# EAGLE design IMU_PCB (EAGLE 9.6.2)
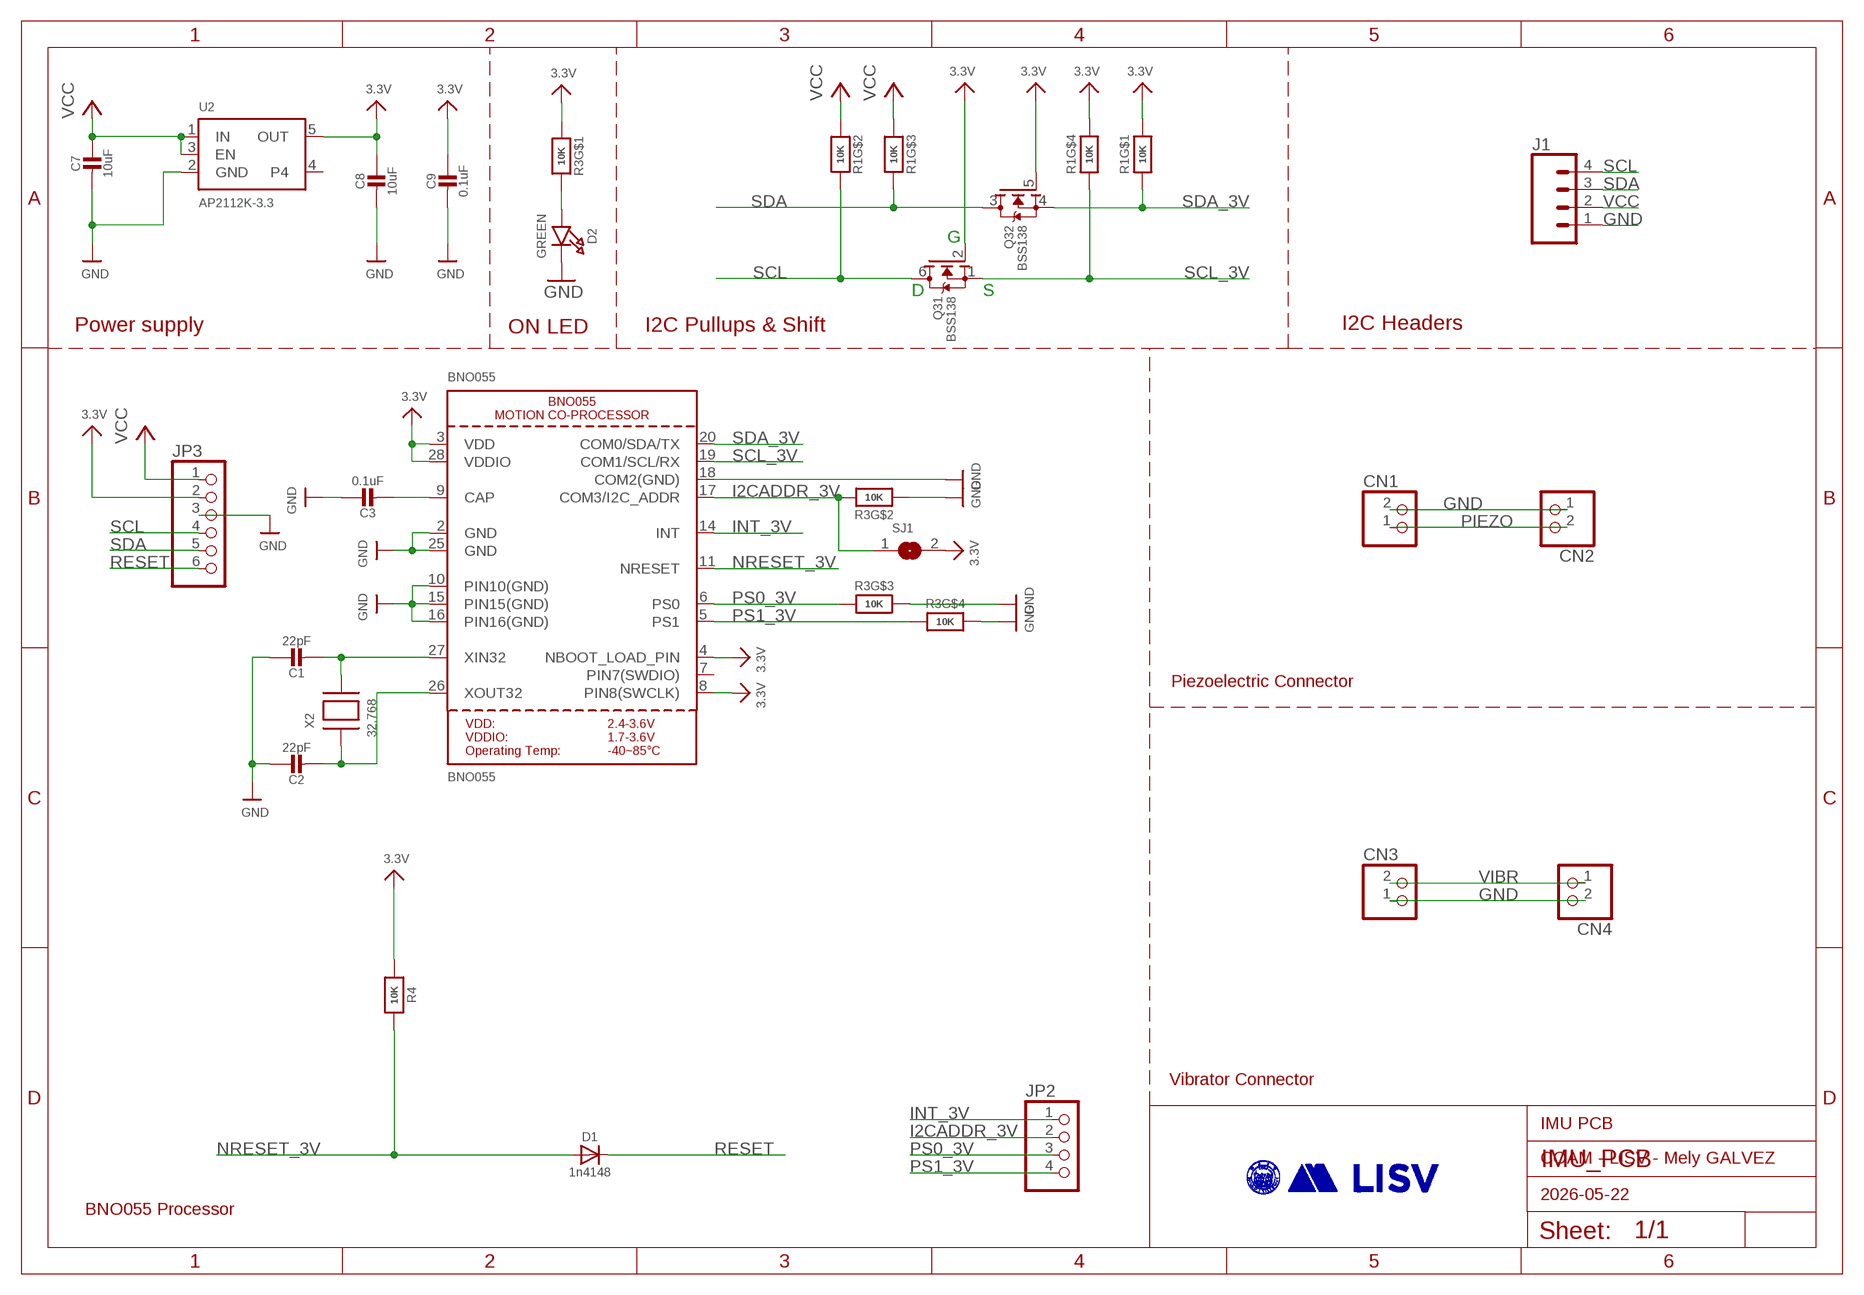
[diagram p0: schematic, sheet 1]

## Parts
BNO055  BNO055  [BNO055]
C1  22pF  CAP_CERAMIC0603_NO  [0603-NO]
C2  22pF  CAP_CERAMIC0603_NO  [0603-NO]
C3  0.1uF  CAP_CERAMIC0603_NO  [0603-NO]
C7  10uF  CAP_CERAMIC0805-NOOUTLINE  [0805-NO]
C8  10uF  CAP_CERAMIC0805-NOOUTLINE  [0805-NO]
C9  0.1uF  CAP_CERAMIC0603_NO  [0603-NO]
CN1  JST_2PIN-SMT-RA  [JST-PH-2-SMT-RA]
CN2  JST_2PIN-SMT-RA  [JST-PH-2-SMT-RA]
CN3  JST_2PIN-SMT-RA  [JST-PH-2-SMT-RA]
CN4  JST_2PIN-SMT-RA  [JST-PH-2-SMT-RA]
D1  1n4148  DIODESOD-323  [SOD-323]
D2  GREEN  LED0603_NOOUTLINE  [CHIPLED_0603_NOOUTLINE]
J1  CONN_04JST-SMD-LOCKING  [JST-4-SMD-1.25MM-LOCKING]
JP2  HEADER-1X476MIL  [1X04_ROUND_76]
JP3  HEADER-1X670MIL  [1X06_ROUND_70]
Q3  BSS138  MOSFET-N_DUAL  [SOT363]
R1  10K  RESISTOR_4PACK  [RESPACK_4X0603]
R3  10K  RESISTOR_4PACK  [RESPACK_4X0603]
R4  10K  RESISTOR_0603_NOOUT  [0603-NO]
SJ1  SOLDERJUMPER  [SOLDERJUMPER_ARROW_NOPASTE]
U2  AP2112K-3.3  VREG_SOT23-5  [SOT23-5]
X2  32.768  XTAL-3.2X1.5  [XTAL3215]

## Nets
3.3V: BNO055.3(VDD) BNO055.4(NBOOT_LOAD_PIN) BNO055.8(PIN8(SWCLK)) BNO055.28(VDDIO) C8.1 C9.1 JP3.2 Q3.2(1:G) Q3.5(2:G) R1.1 R1.4 R3.1 R4.1 SJ1.2 U2.5(OUT)
GND: BNO055.2(GND) BNO055.10(PIN10(GND)) BNO055.15(PIN15(GND)) BNO055.16(PIN16(GND)) BNO055.18(COM2(GND)) BNO055.25(GND) C1.1 C2.1 C3.1 C7.2 C8.2 C9.2 CN1.2 CN2.1 CN3.1 CN4.2 D2.C J1.1 JP3.3 R3.2 R3.5 R3.6 U2.2(GND)
I2CADDR_3V: BNO055.17(COM3/I2C_ADDR) JP2.2 R3.7 SJ1.1
INT_3V: BNO055.14(INT) JP2.1
N$1: BNO055.27(XIN32) C1.2 X2.P$2
N$2: BNO055.26(XOUT32) C2.2 X2.P$1
N$3: BNO055.9(CAP) C3.2
N$4: D2.A R3.8
NRESET_3V: BNO055.11(NRESET) D1.A R4.2
PIEZO: CN1.1 CN2.2
PS0_3V: BNO055.6(PS0) JP2.3 R3.3
PS1_3V: BNO055.5(PS1) JP2.4 R3.4
RESET: D1.C JP3.6
SCL: J1.4 JP3.4 Q3.6(1:D) R1.7
SCL_3V: BNO055.19(COM1/SCL/RX) Q3.1(1:S) R1.5
SDA: J1.3 JP3.5 Q3.3(2:D) R1.6
SDA_3V: BNO055.20(COM0/SDA/TX) Q3.4(2:S) R1.8
VCC [highpower]: C7.1 J1.2 JP3.1 R1.2 R1.3 U2.1(IN) U2.3(EN)
VIBR: CN3.2 CN4.1
Unconnected: BNO055.7(PIN7(SWDIO)) U2.4

## Notes on the sheet
- G
- D | S
- Power supply | ON LED | I2C Pullups & Shift | I2C Headers
- Piezoelectric Connector
- Vibrator Connector
- IMU PCB
- COAM - LISV - Mely GALVEZ
- 2026-05-22
- BNO055 Processor

## Library data of the parts
BNO055 = microbuilder:BNO055: BNO055 - Motion Co-Processor
C1-C3 C7-C9 = microbuilder:CAP_CERAMIC: Ceramic Capacitors For new designs, use the packages preceded by an '_' character since they are more reliable: The following footprints should be used on most boards: _0402 - Standard footprint for regular board layouts _0603 - Standard footprint for regular board layouts _0805 - Standard footprint for regular board layouts _1206 - Standard footprint for regular board layouts For extremely tight-pitch boards where space is at a premium, the following 'micro-pitch' footprints can be used (smaller pads, no silkscreen outline, etc.): _0402MP - Micro-pitch footprint for very dense/compact boards _0603MP - Micro-pitch footprint for very dense/compact boards _0805MP - Micro-pitch footprint for very dense/compact boards _1206MP - Micro-pitch footprint for very dense/compact boards
CN1-CN4 = adafruit:JST_2PIN: JST 2-Pin Connectors of various flavors SMT-RA (S2B-PH-SM4) 4UConnector #17311 SMT (B2B-PH-SM4) THM-RA (S2B-PH) THM (B2B-PH)
D1 = microbuilder:DIODE: Diode SMA Model Volts Amps Type Vf Ir Digikey # Notes SSA34-E3 40V 3A Schottky 480mV @ 3A 200uA @ 40V SSA34-E3/61TGITR-ND CDBA120-G 20V 1A Schottky 500mV @ 1A 500uA @ 20V 641-1014-6-ND REEL MBRA210 10V 2A Schottky 350mV @ 2A 700uA @ 10V MBRA210LT3 SOD-123 Model Volts Amps Type Vf Ir Order # Notes BAT54T1G 30V 200mA Schottky 800mV @ 200mA 2uA @ 25V BAT54T1GOSTR-ND B0530W 30V 500mA Schottky 430mV @ 500mA 130uA @ 30V B0530W-FDICT-ND REEL MBR120 20V 1A Schottky 340mV @ 1A MBR120VLSFT1GOSCT-ND SOD-323 Model Volts Amps Type Vf Ir Order # Notes PMEG2005EJ 20V 500mA Schottky 355mV @ 500mA 568-4110-1-ND ZLLS410 10V 570mA Schottky 380mV @ 570mA ZLLS410CT-ND 1N4148WS 75V 150mA Silicon/Simple 1V 1N4148WSFSCT-ND REEL SOD-523 Model Volts Amps Type Vf Ir Order # Notes BAT54XV2 30V 200mA Schottky 0.8V @ 100mA BAT54XV2CT-ND TB751S 30V 30mA Schottky RB751S-40TE61CT-ND SOT23-R/W (R = Solder Paste/Reflow Ovens, W = Hand-Soldering) Model Volts Amps Type Vf Ir Order # Notes BAT54FILM 40V 300mA Schottky 497-7162-1-ND POWERDI-5 Model Volts Amps Type Vf Ir Order # Notes PDS560 60V 5A Schottky 670mV @ 5A 150uA @ 60V PDS560DICT-ND
D2 = microbuilder:LED: LED 0603 - 0603 Surface Mount Package 2mA: Green LED - Low Power (3.9mcd, 2ma, 1.7Vf) - Digikey: 475-2709-2-ND Orange LED - Low Power (9.8mcd, 2ma, 1.8Vf) - Digikey: 475-1194-2-ND Red LED - Low Power (5mcd, 2ma, 1.8Vf) - Digikey: 475-1195-2-ND Yellow LED - Low Power (7mcd, 2ma, 1.8Vf) - Digikey: 475-1196-2-ND 5mA: Blue LED - Low Power (17mcd, 5ma, 2.9Vf) - Digikey: LNJ937W8CRACT-ND 0805 - 0805 Surface Mount Package 2mA: Red LED (8.8mcd, 2mA, 1.8Vf, Clear) - Low Power [Digikey: 475-2510-1-ND] Green LED (5mcd, 2mA, 1.8Vf, Clear) - Low Power [Digikey: 475-2730-1-ND] Yellow LED (11.3mcd, 2mA, 1.8Vf, Clear) - Low Power [Digikey: 475-2555-1-ND] 20mA: Red LED (104mcd, 20mA, Diffused) - LS R976 [Digikey: 475-1278-6-ND] Red LED (12mcd, 20mA, 2.0Vf, Clear) - APT2012EC [Digikey: 754-1128-1-ND] Green LED (15mcd, 20mA, 2.2Vf, Clear) - APT2012GC [Digikey: 754-1131-1-ND] Orange LED (160mcd, 20mA, 2.1Vf, Clear) - APT2012SECK [Digikey: 754-1130-1-ND] 1206 - 1206 Surface Mount Package Green LED (26mcd, 20mA, Diffused) - LG N971 [Digikey: 475-1407-6-ND] Red LED (15mcd, 20mA, Diffused) - LH N974 [Digikey: 475-1416-6-ND] Cree - Cree High-Power Surface Mount LEDs XPEBWT-L1-0000-00D50 - White 111lm 350mA 2.9Vf 6200K 110° XTEAWT-00-0000-00000LEE3 - White 114lm 350mA 2.85Vf 5000K 115° Everlight - Everlight 45-21 Series Surface Mount LEDs 45-21/QK2C-B2832AC2CB2/2T - Warm White 2000mcd 20mA 3.25Vf 3050K 120° 45-21/LK2C-B38452C4CB2/2T - Nuetral White 2000mcd 20mA 3.25Vf 4150K 120° 45-21/LK2C-B50634C6CB2/2T - Cold White 2200mcd 20mA 3.25Vf 5650K 120° PLCC2 Reverse Mount LS T77K-J1L2-1-0-2-R18-Z - Red 11.25mcd 2mA 1.8Vf 630nm 120° LO T77K-L1M2-24-Z - Orange 19.6mcd 2mA 1.8Vf 606nm 120° LY T77K-K2M1-26-Z - Yellow 15.7mcd 2mA 1.8Vf 587nm 120°
J1 = SparkFun-Connectors:CONN_04: Multi connection point. Often used as Generic Header-pin footprint for 0.1 inch spaced/style header connections On any of the 0.1 inch spaced packages, you can populate with these: Break Away Headers - Straight <https://www.sparkfun.com/products/116> (PRT-00116) Break Away Male Headers - Right Angle <https://www.sparkfun.com/products/553> (PRT-00553) Female Headers <https://www.sparkfun.com/products/115> (PRT-00115) Break Away Headers - Machine Pin <https://www.sparkfun.com/products/117> (PRT-00117) Break Away Female Headers - Swiss Machine Pin <https://www.sparkfun.com/products/743> (PRT-00743) For SCREWTERMINALS and SPRING TERMINALS visit here: Screw Terimnals on SparkFun.com <https://www.sparkfun.com/search/results?term=Screw+Terminals> (5mm/3.5mm/2.54mm spacing) This device is also useful as a general connection point to wire up your design to another part of your project. Our various solder wires solder well into these plated through hole pads. Hook-Up Wire - Assortment (Stranded, 22 AWG) <https://www.sparkfun.com/products/11375> (PRT-11375) Hook-Up Wire - Assortment (Solid Core, 22 AWG) <https://www.sparkfun.com/products/11367> (PRT-11367) View the entire wire category on our website here <https://www.sparkfun.com/categories/141> Special notes: Molex polarized connector foot print use with SKU : PRT-08231 with associated crimp pins and housings. 1MM SMD Version SKU: PRT-10208; PROD_ID: CONN-15303
JP2 = microbuilder:HEADER-1X4: PIN HEADER
JP3 = microbuilder:HEADER-1X6: PIN HEADER
Q3 = microbuilder:MOSFET-N_DUAL: Dual N-Channel MOSFET SOT363 (2.0x1.25mm) 2N7002PS - 60V, 320mA [Digikey: 568-5984-1-ND]
R1 R3 = microbuilder:RESISTOR_4PACK: Resistor Packs (4 resistors) 4 x 0603 10K 1/16W - Digikey: YC164J-10KCT-ND
R4 = microbuilder:RESISTOR: Resistors For new designs, use the packages preceded by an '_' character since they are more reliable: The following footprints should be used on most boards: _0402 - Standard footprint for regular board layouts _0603 - Standard footprint for regular board layouts _0805 - Standard footprint for regular board layouts _1206 - Standard footprint for regular board layouts For extremely tight-pitch boards where space is at a premium, the following 'micro-pitch' footprints can be used (smaller pads, no silkscreen outline, etc.): _0402MP - Micro-pitch footprint for very dense/compact boards _0603MP - Micro-pitch footprint for very dense/compact boards _0805MP - Micro-pitch footprint for very dense/compact boards _1206MP - Micro-pitch footprint for very dense/compact boards
SJ1 = microbuilder:SOLDERJUMPER: SMD Solder JUMPER Solder the two pads together to create a connection, or remove the solder to break it. REFLOW - Use this footprint for solder paste and reflow ovens. WAVE - Use this footprint for hand-soldering (larger pads). CLOSED - Has a trace between the two pads to ensure it is closed by default. The trace needs to be cut to disable the jumper, and can be closed again by creating a solder bridge between the two pads.; BOM: EXCLUDE
U2 = microbuilder:VREG_SOT23-5: SOT23-5 Fixed Voltage Regulators Part Current Out V Out V In V Dropout θJA (°C/W) TJ (°C) Digikey Part No. ADP121 150mA 3.3V 3.4-5.5V 0.09V @ 150mA -- -- ADP121-AUJZ33R7CT-ND ADP121 150mA 3.0V 3.1-5.5V 0.09V @ 150mA -- -- ADP121-AUJZ30R7CT-ND ADP122 300mA 3.3V 3.4-5.5V 0.085V @ 300mA -- -- ADP122AUJZ-3.3-R7CT-ND ADP1712 300mA 3.3V 3.5-5.5V 0.17V @ 300mA -- -- ADP1712AUJZ-3.3-R7TR-ND AP7311 (Low Cost) 150mA 3.3V 3.5-6V 0.15V @ 150mA -- -- AP7311-33WG-7DICT-ND LD39015M18R 150mA 1.8V 1.9V-5.5V 0.08V @ 100mA -- -- 497-6977-1-ND LP2985A-33DBVR 150mA 3.3V 3.3-16V 0.28V @ 150mA 206 150 296-18479-1-ND MCP1824T-3302E/OT 300mA 3.3V 3.5V-6V 0.2V @ 300mA -- -- MCP1824T-3302E/OTCT-ND MIC5205-2.5YM5 TR 150mA 2.5V 2.7-16V 0.165V @ 150mA -- -- 576-1257-2-ND MIC5205-3.0YM5 TR 150mA 3.0V 3.2V-16V 0.165V @ 150mA -- -- 576-1258-2-ND MIC5205-3.3YM5 TR 150mA 3.3V 3.5V-16V 0.165V @ 150mA -- -- 576-1259-2-ND TPS780330220 150mA 3.3V+2.2V 3.6-5.5V 250mV Max -- -- 296-23332-1-ND TDA3663/N1,135 100mA 3.3V 3.5-45V 0.18V @ 50mA -- -- 568-5343-1-ND Max operating temp can be calculated using θJA, TJ (max junction temperature), and power in watts. Set the "Maximum Ambient Temperature" until it reaches TJ ("Max Junction Temperature"), which is the absolute limit for safe use of the regulator: Heat Sink Temperature Calculator <http://www.daycounter.com/Calculators/Heat-Sink-Temperature-Calculator.phtml> For example, With 12V source into a 3.3V LP2985 and a 30mA load, we are dissipating (12V-3.3V) * 0.03A = 0.261W. With a θJA of 206 °C/W, a TJ of 150°C, and 261mW we can safely use the chip without a heat sink up to 75°C (=147.1°C Junction Temperature).
X2 = adafruit2:XTAL: Low cost SMT crystals, no capacitors included http://www.ladyada.net/library/eagle

## Net classes
1 highpower: width 0.406 mm, drill 0.483 mm

## Board
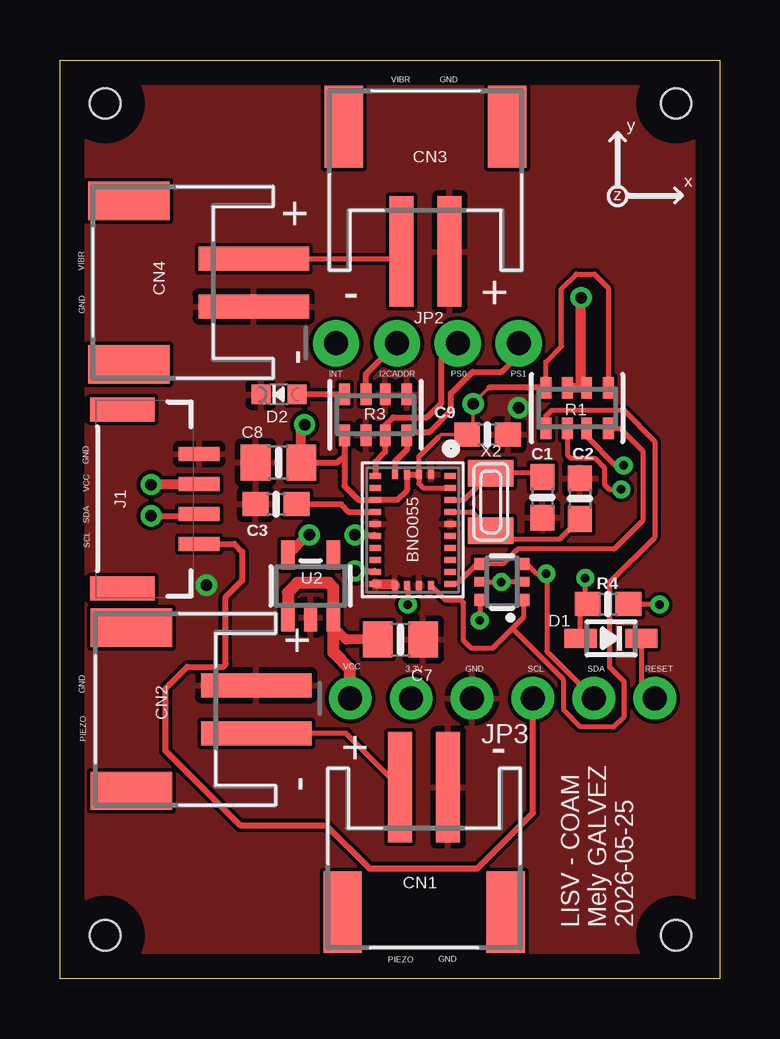
[diagram p1: board, top side]
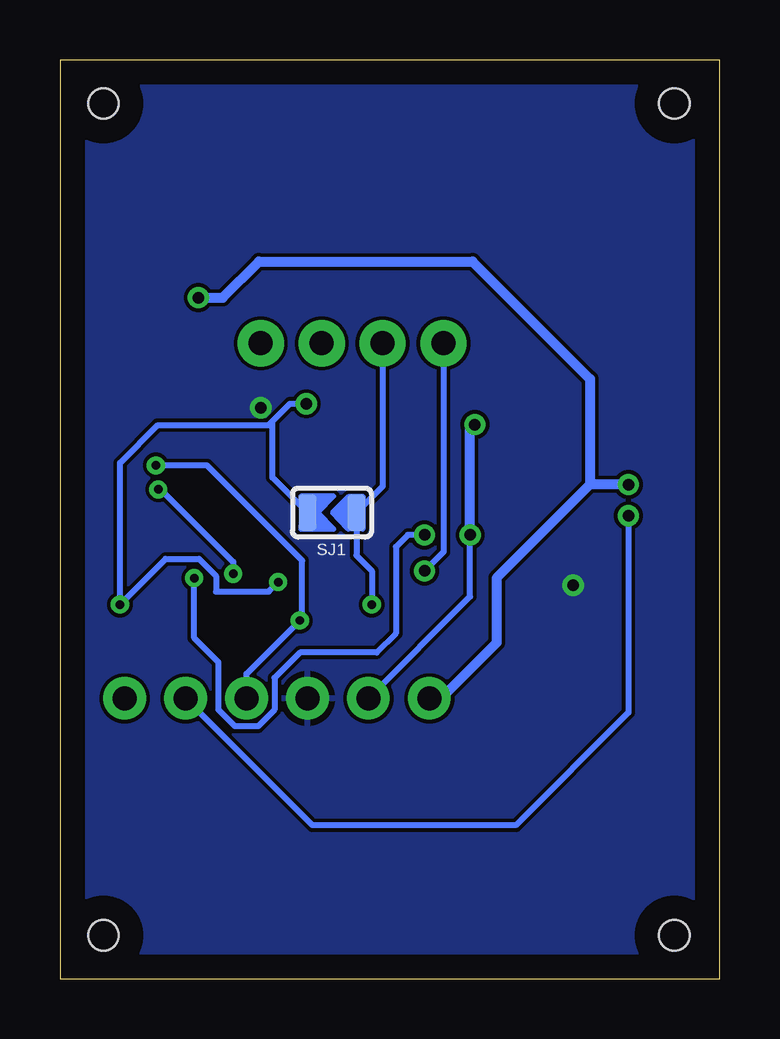
[diagram p2: board, bottom side, seen from below]

Size 27.5 x 38.3 mm. Coordinates in mm from the lower left corner, seen from the top.
Outline: 27.5,0 0,0 0,38.3 27.5,38.3 27.5,0
Copper layers (1*16): Top 0.035mm / dielectric 1.5mm / Bottom 0.035mm
Design rules "default": minimum track width 6mil, minimum drill 0.35mm, track to track 6mil, track to pad 6mil, pad to pad 6mil, via to via 6mil, smd to smd 6mil, copper to edge 40mil, drill to drill 6mil, minimum pad ring 10mil, minimum via ring 8mil, stop-mask expansion 4mil, vias tented up to drill 0mil, thermal gap 10mil
Holes 1.27 mm at 25.69,36.49 25.69,1.81 1.89,1.81 1.89,36.49

### Footprints (pad centres in the part's own frame; a part is rotated, then mirrored left to right if it is on the bottom)
BNO055 = smd 0.25 x 0.475: 1 -2.25,1.562; 6 -2.25,-1.562; 7 -1.75,-1.562; 8 -1.25,-1.562; 9 -0.75,-1.562; 10 -0.25,-1.562; 11 0.25,-1.562; 12 0.75,-1.562; 13 1.25,-1.562; 14 1.75,-1.562; 15 2.25,-1.562; 20 2.25,1.562; 21 1.75,1.562; 22 1.25,1.562; 23 0.75,1.562; 24 0.25,1.562; 25 -0.25,1.562; 26 -0.75,1.562; 27 -1.25,1.562; 28 -1.75,1.562 | smd 0.375 x 0.25: 2 -2.312,0.75; 3 -2.312,0.25; 4 -2.312,-0.25; 5 -2.312,-0.75; 16 2.312,-0.75; 17 2.312,-0.25; 18 2.312,0.25; 19 2.312,0.75
0603-NO = smd 1.075 x 1: 1 -0.85,0; 2 0.85,0
0805-NO = smd 1.24 x 1.5: 1 -0.95,0; 2 0.95,0
JST-PH-2-SMT-RA = smd 1 x 4.6: 1 1,-3.7; 2 -1,-3.7 | smd 1.6 x 3.4: NC1 -3.4,1.5; NC2 3.4,1.5
SOD-323 = smd 1.35 x 0.8: A 1.27,0; C -1.27,0
CHIPLED_0603_NOOUTLINE = smd 0.8 x 0.8: A 0,-0.75; C 0,0.75
JST-4-SMD-1.25MM-LOCKING = smd 0.6 x 1.7: 1 -1.875,3.3; 2 -0.625,3.3; 3 0.625,3.3; 4 1.875,3.3 | smd 1 x 2.7: NC1 3.725,0.1; NC2 -3.725,0.1
1X04_ROUND_76 = drill 1 pad 1.93: 1 -3.81,0; 2 -1.27,0; 3 1.27,0; 4 3.81,0
1X06_ROUND_70 = drill 1 pad 1.778: 1 -6.35,0; 2 -3.81,0; 3 -1.27,0; 4 1.27,0; 5 3.81,0; 6 6.35,0
SOT363 = smd 0.5 x 0.5: 1 -0.75,-0.9; 3 0.75,-0.9; 4 0.75,0.9; 6 -0.75,0.9 | smd 0.4 x 0.5: 2 0,-0.9; 5 0,0.9
RESPACK_4X0603 = smd 0.45 x 0.9: 1 -1.3,-0.85; 2 -0.4,-0.85; 3 0.4,-0.85; 4 1.3,-0.85; 5 1.3,0.85; 6 0.4,0.85; 7 -0.4,0.85; 8 -1.3,0.85
SOLDERJUMPER_ARROW_NOPASTE = smd 0.762 x 1.524: 1 -1.016,0; 2 1.016,0
SOT23-5 = smd 0.55 x 1.2: 1 -0.95,-1.3; 2 0,-1.3; 3 0.95,-1.3; 4 0.95,1.3; 5 -0.95,1.3
XTAL3215 = smd 1.1 x 1.9: P$1 1.2,0; P$2 -1.2,0

### Placement (x,y rotation side)
BNO055  14.71,18.71 270 top
C1  20.12,20.07 90 top
C2  21.68,20.01 270 top
C3  9.01,19.78 0 top
C7  14.2,14.14 0 top
C8  9.11,21.52 180 top
C9  17.83,22.68 0 top
CN1  15.18,4.28 180 top
CN2  4.48,11.23 90 top
CN3  15.24,34.02 0 top
CN4  4.38,29.02 90 top
D1  22.97,14.19 180 top
D2  9.13,24.36 90 top
J1  2.5,20 270 top
JP2  15.32,26.49 0 top
JP3  18.45,11.69 0 top
Q3  18.43,16.54 90 top
R1  21.56,23.79 180 top
R3  13.16,23.51 0 top
R4  22.85,15.62 180 top
SJ1  16.16,19.43 180 bottom
U2  10.45,16.37 0 top
X2  17.96,19.87 270 top

### Tracks (layer width: path | path; a pad name or v marks a point on that pad's centre or on a via)
3.3V  (via drill 0.35, 0.48)
  Top 0.152: 15.78,22.58 15.88,22.68 C9.1 17.22,22.92 v17.22,23.97 17.89,24.64
  Top 0.2: R4.1 24.98,15.62 v25,15.6 | Q3.5 18.39,16.54 | 18.39,16.54 v18.4,16.53 | Q3.2 18.39,16.54 | BNO055.28 15.14,20.46 14.96,20.64 BNO055.3 14.96,21.76 15.78,22.58 | R1.4 20.26,25.71 20.91,26.36 20.91,28.76 21.52,29.37 22.29,29.37 22.86,28.8 R1.1
  Top 0.25: R1.4 17.89,24.64 | BNO055.3 BNO055.4 14.46,20.36 14.06,19.96 BNO055.8 12.44,19.96 11.86,20.54 11.86,21.8 | R3.1 11.86,21.8 | C8.1 11.58,21.52 11.86,21.8 | 10.33,18.5 v10.4,18.5
  Top 0.406: C8.1 10.06,22.96 v10.2,23.1 | U2.5 10.33,18.5
  Bottom 0.25: JP3.2 10.4,15.93 v10.4,18.5 | SJ1.2 18.64,20.89 18.64,23.24 | 18.64,23.24 17.91,23.97 v17.22,23.97 | v18.4,16.53 18.8,16.13 21,16.13 21,16.8 21.7,17.5 23.1,17.5 v25,15.6 25,21.5 23.42,23.08 18.8,23.08 18.64,23.24
  Bottom 0.406: v10.4,18.5 10.4,22.9 v10.2,23.1
GND  (via drill 0.48)
  Top 0.406: BNO055.15 13.9,16.46 BNO055.16
  other vias: 19.13,23.8 6.1,16.4
  pour Bottom: 0,38.3 0,0 27.5,0 27.5,38.3
  pour Top: 0,38.3 0,0 27.5,0 27.5,38.3
I2CADDR_3V  (via drill 0.35)
  Top 0.2: BNO055.17 14.5,16.36 v14.5,15.6
  Top 0.25: R3.7 12.76,25.2 JP2.2
  Bottom 0.25: JP2.2 14.05,20.52 SJ1.1 15.14,17.64 14.5,17 v14.5,15.6
INT_3V  (via drill 0.48)
  Top 0.25: v12.3,17 13.11,17 BNO055.14
  Bottom 0.25: JP2.1 11.51,17.79 v12.3,17
N$1
  Top 0.2: BNO055.27 16.84,19.96 X2.P$2 19.97,21.07 C1.2
N$2
  Top 0.2: BNO055.26 17.17,19.46 X2.P$1 | C2.2 20.85,18.33 18.47,18.33
  Top 0.406: 18.47,18.33 18.13,18.67 X2.P$1
N$3
  Top 0.25: C3.2 11.72,19.78 12.04,19.46 BNO055.9
N$4
  Top 0.25: R3.8 D2.A
NRESET_3V  (via drill 0.35, 0.48)
  Top 0.2: D1.A 21.7,15.32 R4.2 21.9,15.72 v21.9,16.7
  Top 0.25: v12.3,18.5 13.11,18.5 BNO055.11
  Bottom 0.25: v12.3,18.5 13,18.5 13.5,18 13.5,14.4 14.3,13.6 17.5,13.6 18.55,12.55 18.55,11.21 19.24,10.52 20.2,10.52 20.89,11.21 20.89,13.19 21.9,14.2 v21.9,16.7
PIEZO
  Top 0.2: CN1.1 11.93,10.23 CN2.2
PS0_3V
  Top 0.25: JP2.3 15.9,25.8 15.9,24.57 15.9,24 15.3,23.4 13.9,23.4 13.56,23.06 R3.3 13.56,21.96 13.15,21.55 BNO055.6
PS1_3V
  Top 0.25: JP2.4 19.13,26.03 18.4,25.3 17.2,25.3 16.3,24.4 16.3,23.7 15.4,22.8 14.6,22.8 R3.4 14.46,22.06 13.96,21.56 BNO055.5
RESET
  Top 0.2: D1.C 24.24,12.25 JP3.6
SCL  (via drill 0.35)
  Top 0.2: R1.7 21.96,22.59 23.15,21.4 v23.5,21.4 | Q3.6 17.5,15.76 v17.5,14.93
  Top 0.25: J1.4 7.27,18.12 7.6,17.8 7.6,16.6 6.89,15.89 6.89,13.16 6.9,13.16 6.9,13.1 6.81,13.01 5.31,13.01 4.4,12.1 4.4,9.5 7.5,6.4 11.1,6.4 12.9,4.6 17.4,4.6 19.72,6.92 JP3.4
  Bottom 0.25: JP3.4 19.72,12.71 v17.5,14.93 17.4,15.03 17.4,17.43 21.37,21.4 v23.5,21.4
SCL_3V
  Top 0.2: R1.5 20.26,23.46 20.5,23.7 23.5,23.7 24.8,22.4 24.8,18.4 22.91,16.51 22.91,12.99 23.5,12.4 23.5,10.9 23.1,10.5 21.7,10.5 21,11.2 21,12.45 18.86,14.59 | BNO055.19 16.06,15.8 16.7,15.8 16.83,15.67 16.83,14.1 17.16,13.77 18.04,13.77 18.86,14.59 | Q3.1 19.33,15.06 18.86,14.59
SDA  (via drill 0.35, 0.48)
  Top 0.2: R1.6 21.16,21.84 21.3,21.7 22.3,21.7 22.7,21.3 22.7,20.6 22.9,20.4 v23.4,20.4 | Q3.3 19.48,17.29 19.89,16.88 v20.27,16.88 20.3,16.86 20.3,13.65 JP3.5
  Top 0.25: v3.8,19.3 5.72,19.3 J1.3
  Bottom 0.25: v20.27,16.88 20.27,17.38 23.3,20.4 v23.4,20.4 | v3.8,19.3 3.8,11.1 8.5,6.4 16.97,6.4 JP3.5
SDA_3V
  Top 0.2: R1.8 23.36,22.94 24.3,22 24.3,19.1 23.11,17.91 19.08,17.91 18.46,17.29 Q3.4 17.39,17.29 16.56,16.46 BNO055.20
VCC  (via drill 0.48)
  Top 0.406: R1.3 R1.2 21.73,24.87 v21.73,28.39 | v3.8,20.6 3.82,20.62 J1.2 | C7.1 11.93,14.14 11.4,14.67
  Top 0.5: JP3.1 12.1,12.9 11.4,13.6 11.4,14.67 U2.3 11.4,16.3 11.2,16.5 9.9,16.5 9.5,16.1 U2.1
  Bottom 0.406: v3.8,20.6 5.4,20.6 | 5.4,20.6 9.3,16.7 9.3,14 11.61,11.69 JP3.1 | v21.73,28.39 20.71,28.39 19.2,29.9 10.3,29.9 5.4,25 5.4,20.6
VIBR
  Top 0.2: CN4.1 13.94,30.02 CN3.2

### Text on the board
tNames: VIBR | GND | y | x | z | VIBR | GND | INT | I2CADDR | PS0 | PS1 | GND | VCC | SDA | SCL | VCC | 3.3V | GND | SCL | SDA | RESET | GND | PIEZO | LISV - COAM / Mely GALVEZ / 2026-05-25 | PIEZO | GND